# EAGLE design Qwiic_1Wire_to_I2C_Bridge_DS28E17 (EAGLE 7.6.0)
ABBREV: hb1; PROJECT: Heading Board
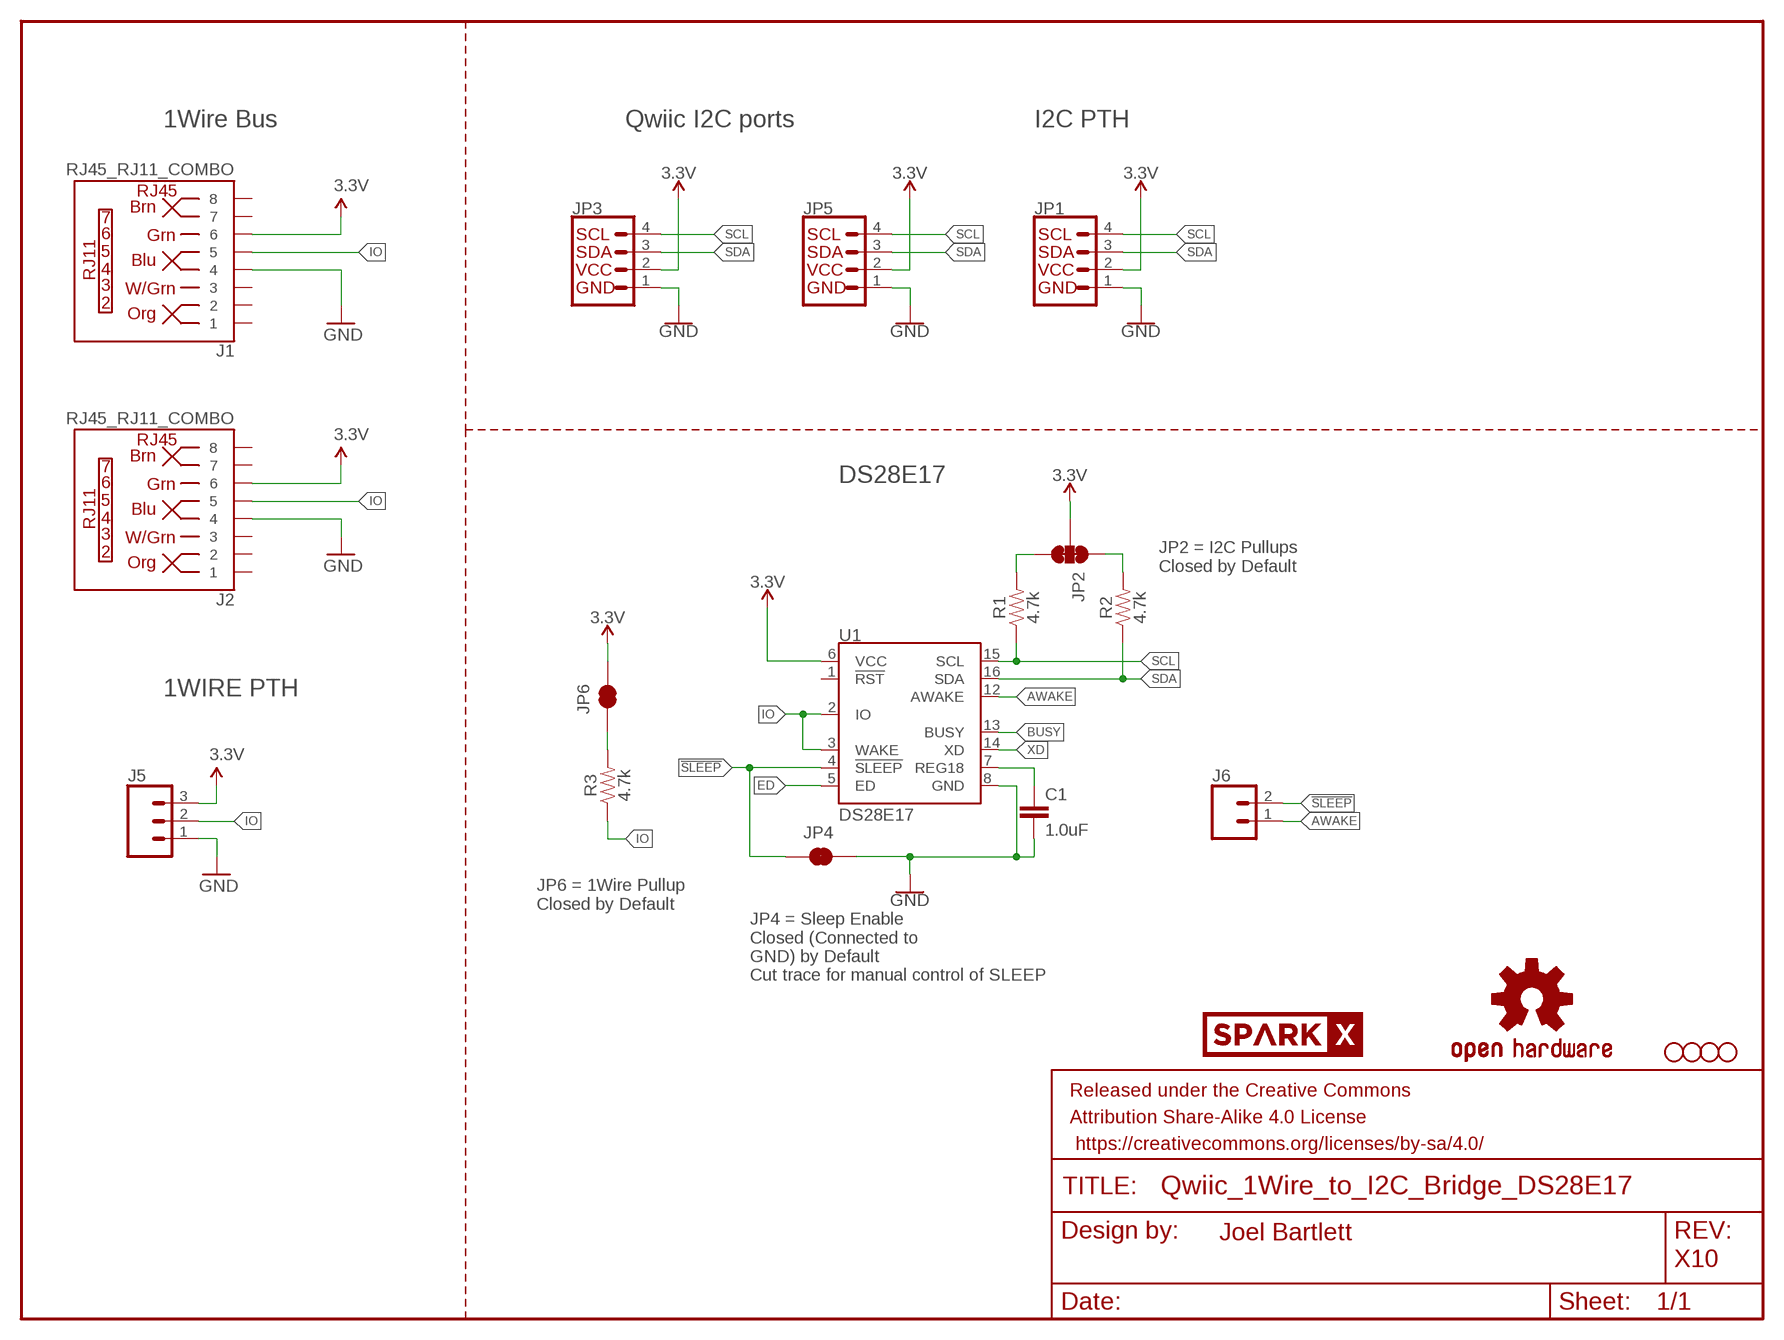
[diagram p0: schematic, sheet 1]

## Parts
C1  1.0uF  1.0UF-0603-16V-10%  [0603]
FRAME1  FRAME-LETTER  [CREATIVE_COMMONS]
H1  STAND-OFF  [STAND-OFF]
H2  STAND-OFF  [STAND-OFF]
H3  STAND-OFF  [STAND-OFF]
H4  STAND-OFF  [STAND-OFF]
J1  RJ45_RJ11_COMBO  [RJ45_RJ11_COMBO]
J2  RJ45_RJ11_COMBO  [RJ45_RJ11_COMBO]
J5  CONN_03  [1X03]
J6  CONN_02  [1X02]
JP1  I2C_STANDARDSILK  [1X04]
JP2  JUMPER-SMT_3_2-NC_TRACE_SILK  [SMT-JUMPER_3_2-NC_TRACE_SILK]
JP3  I2C_STANDARDJS-1MM  [1X04_1MM_RA]
JP4  JUMPER-SMT_2_NC_TRACE_SILK  [SMT-JUMPER_2_NC_TRACE_SILK]
JP5  I2C_STANDARDJS-1MM  [1X04_1MM_RA]
JP6  JUMPER-SMT_2_NC_TRACE_SILK  [SMT-JUMPER_2_NC_TRACE_SILK]
LOGO1  OSHW-LOGOM  [OSHW-LOGO-M]
R1  4.7k  4.7KOHM-0603-1/10W-1%  [0603]
R2  4.7k  4.7KOHM-0603-1/10W-1%  [0603]
R3  4.7k  4.7KOHM-0603-1/10W-1%  [0603]
U1  DS28E17  [TQFN-16]
U$2  SPARKX-LOGO5  [SPARKX-LARGE]
U$3  SPARKX-LOGO5  [SPARKX-LARGE]

## Nets
3.3V: J1.6 J2.6 J5.3 JP1.2(VCC) JP2.2 JP3.2(VCC) JP5.2(VCC) JP6.2 U1.6(VCC)
!SLEEP: J6.2 JP4.1 U1.4(!SLEEP)
AWAKE: J6.1 U1.12(AWAKE)
BUSY: U1.13(BUSY)
ED: U1.5(ED)
GND: C1.2 J1.4 J2.4 J5.1 JP1.1(GND) JP3.1(GND) JP4.2 JP5.1(GND) U1.8(GND)
IO: J1.5 J2.5 J5.2 R3.1 U1.2(IO) U1.3(WAKE)
N$1: C1.1 U1.7(REG18)
N$2: JP6.1 R3.2
N$3: JP2.1 R2.2
N$4: JP2.3 R1.2
SCL: JP1.4(SCL) JP3.4(SCL) JP5.4(SCL) R1.1 U1.15(SCL)
SDA: JP1.3(SDA) JP3.3(SDA) JP5.3(SDA) R2.1 U1.16(SDA)
XD: U1.14(XD)
Unconnected: J1.1 J1.2 J1.3 J1.7 J1.8 J2.1 J2.2 J2.3 J2.7 J2.8 U1.1(!RST)

## Notes on the sheet
- 1Wire Bus | Qwiic I2C ports | I2C PTH
- DS28E17
- JP2 = I2C Pullups
  Closed by Default
- 1WIRE PTH
- JP6 = 1Wire Pullup
  Closed by Default
- JP4 = Sleep Enable
  Closed (Connected to 
  GND) by Default
  Cut trace for manual control of SLEEP
- Joel Bartlett
- X10

## Library data of the parts
C1 = SparkFun-Capacitors:1.0UF: 1µF ceramic capacitors A capacitor is a passive two-terminal electrical component used to store electrical energy temporarily in an electric field.; PROD_ID: CAP-00868
FRAME1 = SparkFun-Aesthetics:FRAME-LETTER: Schematic Frame - Letter Standard 8.5x11 US Letter frame
H1-H4 = SparkFun-Hardware:STAND-OFF: Stand Off Drill holes for mechanically mounting via screws, standoffs, etc. Note: Use the keepout ring to avoid running the screw head into surrounding components. Variant Overviews STAND-OFF - Mechanical footprint for a #4 phillips button head screw. STAND-OFF-TIGHT - Mechanical footprint for a #4 phillips button head screw, Example SparkFun Products Screw - Phillips Head (1/4", 4-40, 10 pack) <https://www.sparkfun.com/products/10453> (PRT-10453) Screw - Phillips Head (1/2", 4-40, 10 pack) <https://www.sparkfun.com/products/10452> (PRT-10452) Screw - Phillips Head (3/4", 4-40, 10 pack) <https://www.sparkfun.com/products/10451> (PRT-10451) Screw - Phillips Head (1", 4-40, 10 pack) <https://www.sparkfun.com/products/10450> (PRT-10450)
J1 J2 = SparkX:RJ45_RJ11_COMBO
J5 = SparkFun-Connectors:CONN_03: Multi connection point. Often used as Generic Header-pin footprint for 0.1 inch spaced/style header connections On any of the 0.1 inch spaced packages, you can populate with these: Break Away Headers - Straight <https://www.sparkfun.com/products/116> (PRT-00116) Break Away Male Headers - Right Angle <https://www.sparkfun.com/products/553> (PRT-00553) Female Headers <https://www.sparkfun.com/products/115> (PRT-00115) Break Away Headers - Machine Pin <https://www.sparkfun.com/products/117> (PRT-00117) Break Away Female Headers - Swiss Machine Pin <https://www.sparkfun.com/products/743> (PRT-00743) Stackable Header - 3 Pin (Female, 0.1") <https://www.sparkfun.com/products/13875> (PRT-13875) For SCREWTERMINALS and SPRING TERMINALS visit here: Screw Terimnals on SparkFun.com <https://www.sparkfun.com/search/results?term=Screw+Terminals> (5mm/3.5mm/2.54mm spacing) This device is also useful as a general connection point to wire up your design to another part of your project. Our various solder wires solder well into these plated through hole pads. Hook-Up Wire - Assortment (Stranded, 22 AWG) <https://www.sparkfun.com/products/11375> (PRT-11375) Hook-Up Wire - Assortment (Solid Core, 22 AWG) <https://www.sparkfun.com/products/11367> (PRT-11367) View the entire wire category on our website here <https://www.sparkfun.com/categories/141> Special notes: Molex polarized connector foot print use with SKU : PRT-08232 with associated crimp pins and housings.
J6 = SparkFun-Connectors:CONN_02: Multi connection point. Often used as Generic Header-pin footprint for 0.1 inch spaced/style header connections On any of the 0.1 inch spaced packages, you can populate with these: Break Away Headers - Straight <https://www.sparkfun.com/products/116> (PRT-00116) Break Away Male Headers - Right Angle <https://www.sparkfun.com/products/553> (PRT-00553) Female Headers <https://www.sparkfun.com/products/115> (PRT-00115) Break Away Headers - Machine Pin <https://www.sparkfun.com/products/117> (PRT-00117) Break Away Female Headers - Swiss Machine Pin <https://www.sparkfun.com/products/743> (PRT-00743) For SCREWTERMINALS and SPRING TERMINALS visit here: Screw Terimnals on SparkFun.com <https://www.sparkfun.com/search/results?term=Screw+Terminals> (5mm/3.5mm/2.54mm spacing) This device is also useful as a general connection point to wire up your design to another part of your project. Our various solder wires solder well into these plated through hole pads. Hook-Up Wire - Assortment (Stranded, 22 AWG) <https://www.sparkfun.com/products/11375> (PRT-11375) Hook-Up Wire - Assortment (Solid Core, 22 AWG) <https://www.sparkfun.com/products/11367> (PRT-11367) View the entire wire category on our website here <https://www.sparkfun.com/categories/141> Special notes: Molex polarized connector foot print use with: PRT-08233 with associated crimp pins and housings. 2.54_SCREWTERM for use with PRT-10571. 3.5mm Screw Terminal footprints for PRT-08084 5mm Screw Terminal footprints for use with PRT-08432
JP1 JP3 JP5 = SparkX:I2C_STANDARD: SparkFun I2C Standard Pinout Header SparkFun has standardized on a pinout for all I2C based sensor breakouts. This pinout allows I2C boards to be plugged directly into the headers on Arduino Uno compatible boards, and to be daisy chained easily. Example SparkFun Products: SparkFun Atmospheric Sensor Breakout - BME280 <https://www.sparkfun.com/products/13676> SparkFun Altitude/Pressure Sensor Breakout - MPL3115A2 <https://www.sparkfun.com/products/11084> SparkFun TOF Range Finder Sensor - VL6180 <https://www.sparkfun.com/products/12785>
JP2 = SparkFun-Jumpers:JUMPER-SMT_3_2-NC_TRACE: Normally closed trace jumper (2 of 2 connections) This jumper has a trace between all three pads so they are normally closed (NC). Use a razor knife to open the connection(s). For best results follow the IPC guidelines for cutting traces: Cutout at least 0.063 mm (0.005 in). Remove all loose material to clean up the cut area. Seal the cut with an approved epoxy. Reapply solder to reclose the connection(s).
JP4 JP6 = SparkFun-Jumpers:JUMPER-SMT_2_NC_TRACE: Normally closed trace jumper This jumper has a trace between two pads so it's normally closed (NC). Use a razor knife to open the connection. For best results follow the IPC guidelines for cutting traces: Cutout at least 0.063 mm (0.005 in). Remove all loose material to clean up the cut area. Seal the cut with an approved epoxy. Reapply solder to reclose the connection.
LOGO1 = SparkFun-Aesthetics:OSHW-LOGO: Open-Source Hardware (OSHW) Logo This logo indicates the piece of hardware it is found on incorporates a OSHW license and/or adheres to the definition of open source hardware found here: http://freedomdefined.org/OSHW
R1-R3 = SparkFun-Resistors:4.7KOHM: 4.7kΩ resistor A resistor is a passive two-terminal electrical component that implements electrical resistance as a circuit element. Resistors act to reduce current flow, and, at the same time, act to lower voltage levels within circuits. - Wikipedia; PROD_ID: RES-07857
U1 = SparkX:DS28E17
U$2 U$3 = SparkX:SPARKX-LOGO

## Net classes
0 default: width 0.203 mm
1 power: width 0.381 mm, clearance 0.254 mm

## Board
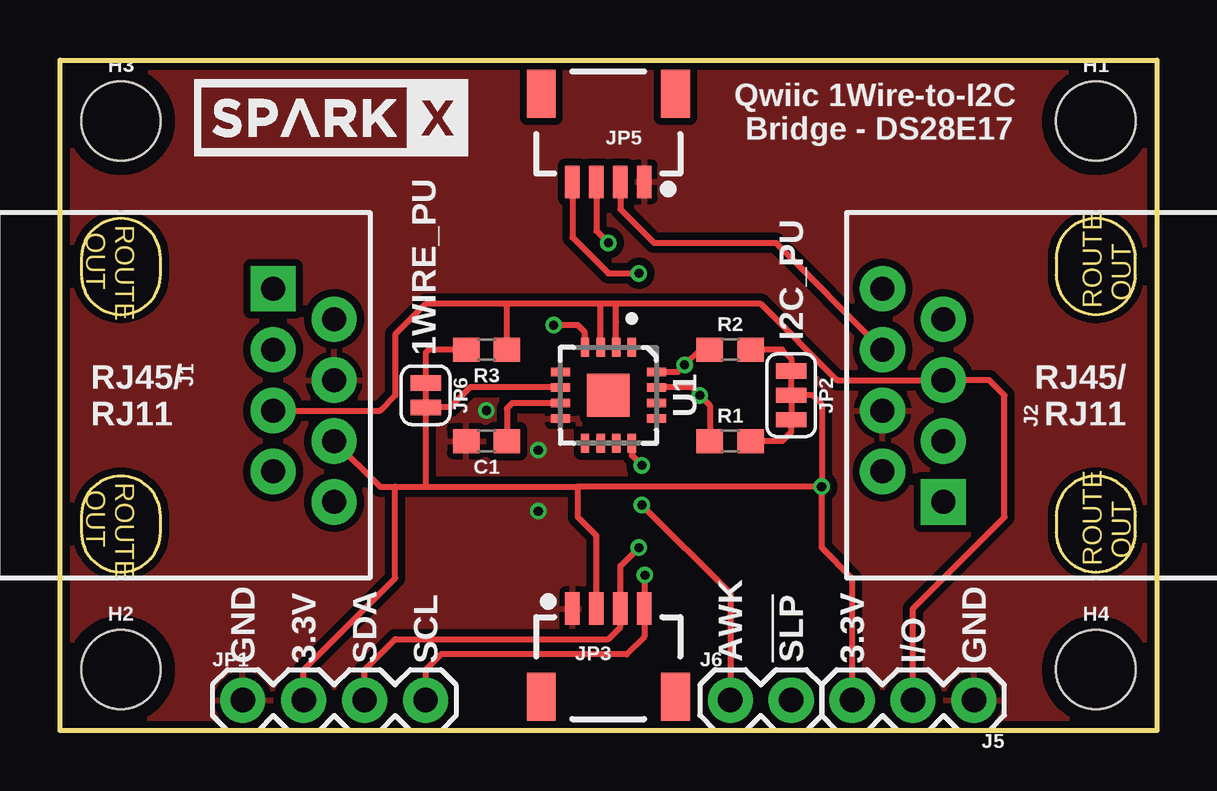
[diagram p1: board, top side]
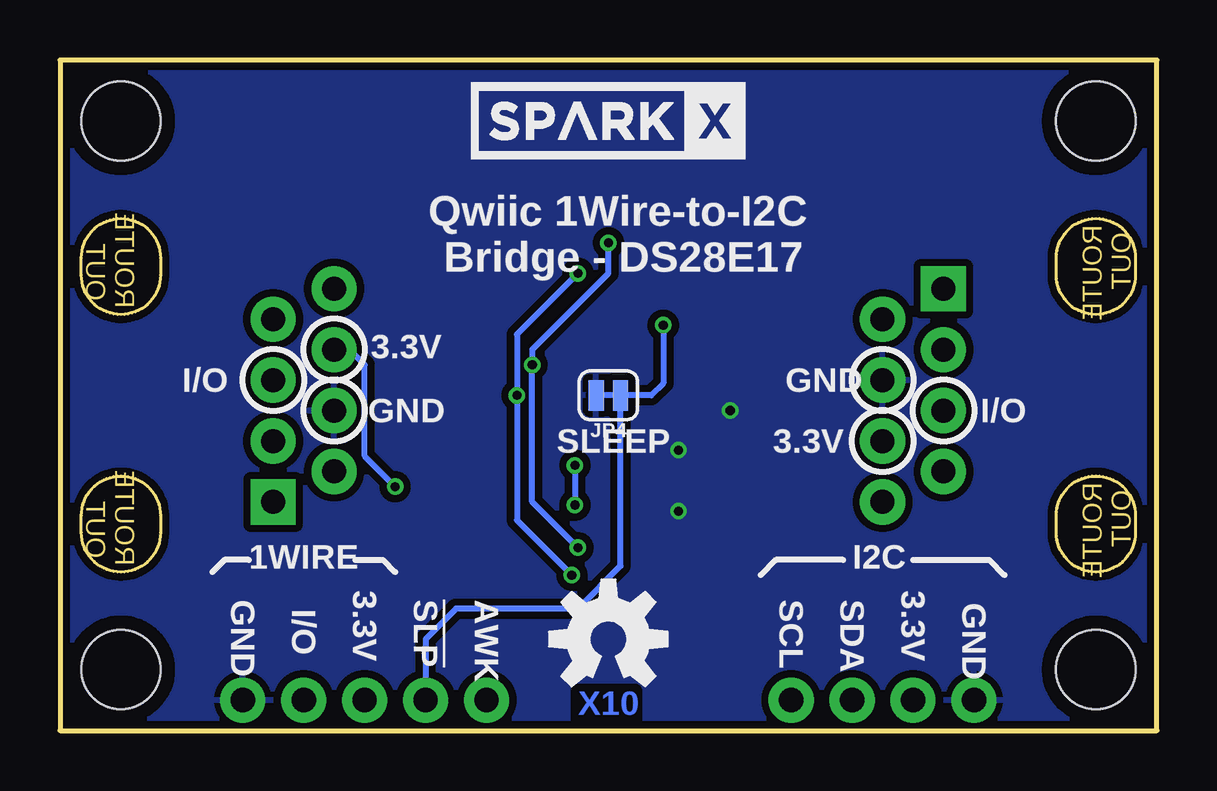
[diagram p2: board, bottom side, seen from below]

Size 45.72 x 27.94 mm. Coordinates in mm from the lower left corner, seen from the top.
Outline: 0,0 0,27.94 45.72,27.94 45.72,0 0,0
Copper layers (1*16): Top 0.035mm / dielectric 1.5mm / Bottom 0.035mm
Design rules "ITEADstudio_DRC": minimum track width 6mil, minimum drill 12mil, track to track 6mil, track to pad 6mil, pad to pad 6mil, via to via 6mil, smd to smd 0mil, copper to edge 10mil, drill to drill 10mil, minimum pad ring 10mil, minimum via ring 6mil, stop-mask expansion 2mil, vias tented up to drill 100mil, thermal gap 10mil

### Footprints (pad centres in the part's own frame; a part is rotated, then mirrored left to right if it is on the bottom)
0603 = smd 1.1 x 1: 1 -0.85,0; 2 0.85,0
STAND-OFF = hole 3.302: 0,0
RJ45_RJ11_COMBO = drill 1 pad 1.88 square: 1 -4.445,6.35 | drill 1 pad 1.88: 2 -3.175,8.89; 3 -1.905,6.35; 4 -0.635,8.89; 5 0.635,6.35; 6 1.905,8.89; 7 3.175,6.35; 8 4.445,8.89
1X03 = drill 1.016 pad 1.88: 1 0,0; 2 2.54,0; 3 5.08,0
1X02 = drill 1.016 pad 1.88: 1 0,0; 2 2.54,0
1X04 = drill 1.016 pad 1.88: 1 0,0; 2 2.54,0; 3 5.08,0; 4 7.62,0
SMT-JUMPER_3_2-NC_TRACE_SILK = smd 0.635 x 1.27: 1 -1.016,0; 2 0,0; 3 1.016,0
1X04_1MM_RA = smd 0.6 x 1.35: 1 -1.5,0; 2 -0.5,0; 3 0.5,0; 4 1.5,0 | smd 1.2 x 2: NC1 2.8,-3.675; NC2 -2.8,-3.675
SMT-JUMPER_2_NC_TRACE_SILK = smd 0.635 x 1.27: 1 -0.508,0; 2 0.508,0
TQFN-16 = smd 0.8 x 0.35: 1 -2,0.975; 2 -2,0.325; 3 -2,-0.325; 4 -2,-0.975; 9 2,-0.975; 10 2,-0.325; 11 2,0.325; 12 2,0.975 | smd 0.35 x 0.8: 5 -0.975,-2; 6 -0.325,-2; 7 0.325,-2; 8 0.975,-2; 13 0.975,2; 14 0.325,2; 15 -0.325,2; 16 -0.975,2 | smd 1.778 x 1.778: PAD 0,0

### Placement (x,y rotation side)
C1  17.78,12.06 180 top
FRAME1  -5.08,-16.51 0 top  (outside the outline)
H1  43.18,25.4 0 top
H2  2.54,2.54 0 top
H3  2.54,25.4 0 top
H4  43.18,2.54 0 top
J1  2.54,13.97 270 top
J2  43.18,13.97 90 top
J5  38.1,1.27 180 top
J6  27.94,1.27 0 top
JP1  7.62,1.27 0 top
JP2  30.48,13.97 270 top
JP3  22.86,5.08 0 top
JP4  22.86,13.97 180 bottom
JP5  22.86,22.86 180 top
JP6  15.24,13.97 270 top
LOGO1  22.86,3.81 0 bottom
R1  27.94,12.06 0 top
R2  27.94,15.88 0 top
R3  17.78,15.88 180 top
U1  22.86,13.97 270 top
U$2  11.3,25.53 0 top
U$3  22.86,25.4 0 bottom

### Tracks (layer width: path | path; a pad name or v marks a point on that pad's centre or on a via)
3.3V  (via drill 0.38)
  Top 0.254: JP3.2 22.36,8.12 21.59,8.89 21.59,10.16 | JP1.2 10.16,2.54 13.97,6.35 13.97,10.16 | v31.75,10.16 31.75,13.59 31.37,13.97 JP2.2 | JP5.2 23.36,21.73 24.77,20.32 29.84,20.32 J2.6 | J1.6 13.34,10.16 13.97,10.16 | U1.6 17.09,14.29 16.26,13.46 JP6.2 15.24,10.16 | 13.97,10.16 15.24,10.16 | 15.24,10.16 21.59,10.16 | v31.75,10.16 21.59,10.16 | v31.75,10.16 31.75,7.62 33.02,6.35 J5.3
  Bottom 0.254: J2.6 33.66,15.88 33.02,15.24 33.02,11.43 v31.75,10.16
!SLEEP  (via drill 0.38)
  Top 0.254: U1.4 21.89,16.6 21.59,16.89 v20.57,16.89
  Bottom 0.254: v20.57,16.89 20.57,14.48 21.08,13.97 JP4.1 22.35,6.86 24.13,5.08 29.21,5.08 30.48,3.81 J6.2
AWAKE  (via drill 0.38)
  Top 0.254: U1.12 23.84,11.47 v24.26,11.05 | v24.26,9.4 27.94,5.71 J6.1
  Bottom 0.254: v24.26,11.05 v24.26,9.4
GND  (via drill 0.38)
  other vias: 17.78,13.34 19.94,11.68 19.94,9.14
  pour Bottom (isolate 0.305): 0,0 45.72,0 45.72,27.94 0,27.94
  pour Top (isolate 0.305): 0,0 45.72,0 45.72,27.94 0,27.94
IO
  Top 0.254: J1.5 13.34,13.34 13.97,13.97 13.97,16.51 15.24,17.78 18.63,17.78 | U1.3 22.54,17.78 | 23.18,17.02 U1.2 23.18,17.78 | R3.1 18.63,17.78 | 23.18,17.78 29.21,17.78 32.38,14.61 J2.5 38.73,14.61 39.37,13.97 39.37,8.89 35.56,5.08 J5.2 | 22.54,17.78 18.63,17.78 | 23.18,17.78 22.54,17.78
N$1
  Top 0.254: U1.7 18.85,13.64 18.63,13.42 C1.1
N$2
  Top 0.254: R3.2 15.37,15.88 15.24,15.75 JP6.1
N$3
  Top 0.254: R2.2 30.1,15.88 30.48,15.49 JP2.1
N$4
  Top 0.254: R1.2 30.1,12.06 30.48,12.45 JP2.3
SCL  (via drill 0.38)
  Top 0.254: JP5.4 21.36,20.55 22.86,19.05 v24.13,19.05 | JP1.4 15.24,2.54 15.88,3.17 23.62,3.17 24.36,3.91 JP3.4 24.36,6.45 v24.38,6.48 | R1.1 27.09,13.55 v26.67,13.97 26.34,14.29 U1.15
  Bottom 0.254: v24.13,19.05 26.67,16.51 v26.67,13.97 26.67,8.76 v24.38,6.48
SDA  (via drill 0.38)
  Top 0.254: JP5.3 22.36,20.82 v22.86,20.32 | JP1.3 12.7,2.54 13.97,3.81 22.86,3.81 23.36,4.31 JP3.3 23.36,6.85 v24.13,7.62 | U1.16 25.74,14.95 v26.04,15.24 26.67,15.88 R2.1
  Bottom 0.254: v24.13,7.62 26.04,9.53 v26.04,15.24 26.04,15.88 22.86,19.05 v22.86,20.32

### Text on the board
Bottom: X10
tPlace: Qwiic 1Wire-to-I2C / Bridge - DS28E17 | 1WIRE_PU | I2C_PU | RJ45/ / RJ11 | RJ45/ / RJ11 | GND | 3.3V | SDA | SCL | AWK | !SLP | 3.3V | I/O | GND
bPlace: Qwiic 1Wire-to-I2C / Bridge - DS28E17 | 3.3V | GND | I/O | I/O | GND | 3.3V | SLEEP | I2C | 1WIRE | 3.3V | 3.3V | GND | SDA | SCL | AWK | !SLP | I/O | GND
tDocu: Joel Bartlett